# EAGLE design panel (EAGLE 7.2.0)
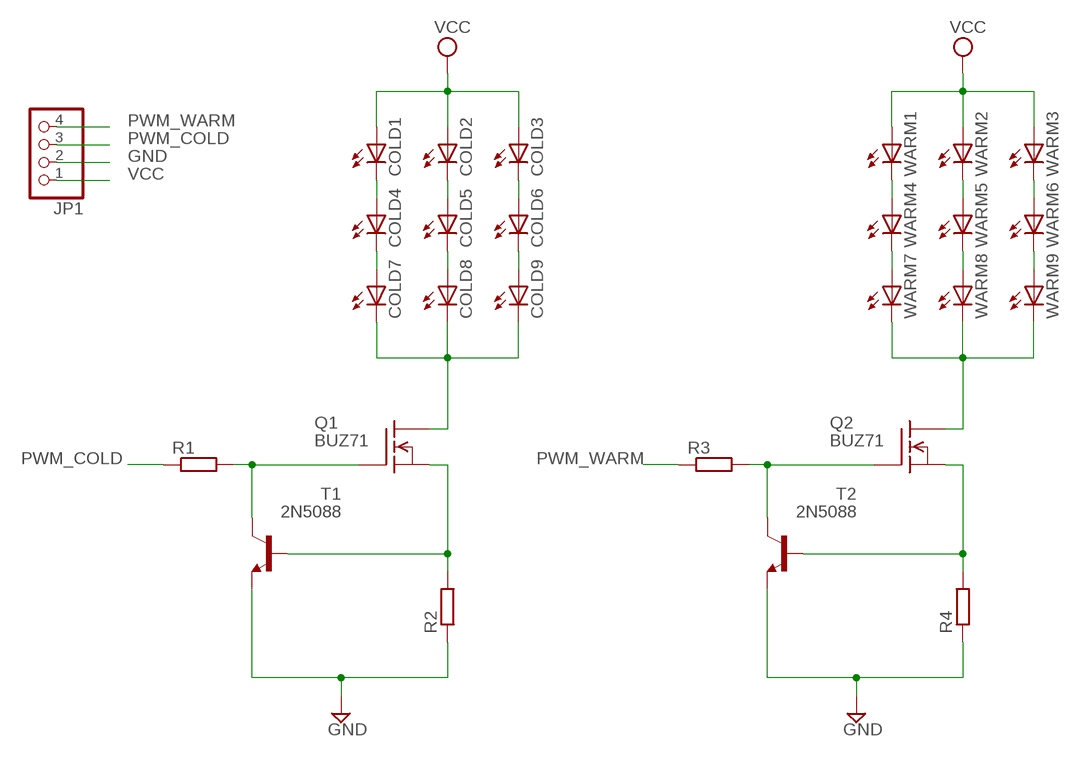
[diagram p0: schematic, sheet 1]

## Parts
COLD1  LEDP-LCC-2  [P-LCC-2]
COLD2  LEDP-LCC-2  [P-LCC-2]
COLD3  LEDP-LCC-2  [P-LCC-2]
COLD4  LEDP-LCC-2  [P-LCC-2]
COLD5  LEDP-LCC-2  [P-LCC-2]
COLD6  LEDP-LCC-2  [P-LCC-2]
COLD7  LEDP-LCC-2  [P-LCC-2]
COLD8  LEDP-LCC-2  [P-LCC-2]
COLD9  LEDP-LCC-2  [P-LCC-2]
JP1  PINHD-1X4  [1X04]
Q1  BUZ71  [TO220]
Q2  BUZ71  [TO220]
R1  R-EU_0207/10  [0207/10]
R2  R-EU_0207/10  [0207/10]
R3  R-EU_0207/10  [0207/10]
R4  R-EU_0207/10  [0207/10]
T1  2N5088  [TO92]
T2  2N5088  [TO92]
WARM1  LEDP-LCC-2  [P-LCC-2]
WARM2  LEDP-LCC-2  [P-LCC-2]
WARM3  LEDP-LCC-2  [P-LCC-2]
WARM4  LEDP-LCC-2  [P-LCC-2]
WARM5  LEDP-LCC-2  [P-LCC-2]
WARM6  LEDP-LCC-2  [P-LCC-2]
WARM7  LEDP-LCC-2  [P-LCC-2]
WARM8  LEDP-LCC-2  [P-LCC-2]
WARM9  LEDP-LCC-2  [P-LCC-2]

## Nets
GND: JP1.2 R2.1 R4.1 T1.3(E) T2.3(E)
N$1: COLD1.C COLD4.A
N$2: COLD4.C COLD7.A
N$3: COLD2.C COLD5.A
N$4: COLD5.C COLD8.A
N$5: COLD3.C COLD6.A
N$6: COLD6.C COLD9.A
N$7: COLD7.C COLD8.C COLD9.C Q1.2(D)
N$8: Q1.3(S) R2.2 T1.2(B)
N$9: WARM1.C WARM4.A
N$10: Q1.1(G) R1.2 T1.1(C)
N$11: WARM4.C WARM7.A
N$12: WARM2.C WARM5.A
N$13: WARM5.C WARM8.A
N$14: WARM3.C WARM6.A
N$16: Q2.2(D) WARM7.C WARM8.C WARM9.C
N$17: Q2.3(S) R4.2 T2.2(B)
N$18: Q2.1(G) R3.2 T2.1(C)
PWM_COLD: JP1.3 R1.1
PWM_WARM: JP1.4 R3.1
VCC: COLD1.A COLD2.A COLD3.A JP1.1 WARM1.A WARM2.A WARM3.A
WARM6: WARM6.C WARM9.A

## Library data of the parts
COLD1-COLD9 WARM1-WARM9 = led:LED: LED OSRAM: - CHIPLED LG R971, LG N971, LY N971, LG Q971, LY Q971, LO R971, LY R971 LH N974, LH R974 LS Q976, LO Q976, LY Q976 LO Q996 - Hyper CHIPLED LW Q18S LB Q993, LB Q99A, LB R99A - SideLED LS A670, LO A670, LY A670, LG A670, LP A670 LB A673, LV A673, LT A673, LW A673 LH A674 LY A675 LS A676, LA A676, LO A676, LY A676, LW A676 LS A679, LY A679, LG A679 - Hyper Micro SIDELED® LS Y876, LA Y876, LO Y876, LY Y876 LT Y87S - SmartLED LW L88C, LW L88S LB L89C, LB L89S, LG L890 LS L89K, LO L89K, LY L89K LS L896, LA L896, LO L896, LY L896 - TOPLED LS T670, LO T670, LY T670, LG T670, LP T670 LSG T670, LSP T670, LSY T670, LOP T670, LYG T670 LG T671, LOG T671, LSG T671 LB T673, LV T673, LT T673, LW T673 LH T674 LS T676, LA T676, LO T676, LY T676, LB T676, LH T676, LSB T676, LW T676 LB T67C, LV T67C, LT T67C, LS T67K, LO T67K, LY T67K, LW E67C LS E67B, LA E67B, LO E67B, LY E67B, LB E67C, LV E67C, LT E67C LW T67C LS T679, LY T679, LG T679 LS T770, LO T770, LY T770, LG T770, LP T770 LB T773, LV T773, LT T773, LW T773 LH T774 LS E675, LA E675, LY E675, LS T675 LS T776, LA T776, LO T776, LY T776, LB T776 LHGB T686 LT T68C, LB T68C - Hyper Mini TOPLED® LB M676 - Mini TOPLED Santana® LG M470 LS M47K, LO M47K, LY M47K Source: http://www.osram.convergy.de LUXEON: - LUMILED® LXK2-PW12-R00, LXK2-PW12-S00, LXK2-PW14-U00, LXK2-PW14-V00 LXK2-PM12-R00, LXK2-PM12-S00, LXK2-PM14-U00 LXK2-PE12-Q00, LXK2-PE12-R00, LXK2-PE12-S00, LXK2-PE14-T00, LXK2-PE14-U00 LXK2-PB12-K00, LXK2-PB12-L00, LXK2-PB12-M00, LXK2-PB14-N00, LXK2-PB14-P00, LXK2-PB14-Q00 LXK2-PR12-L00, LXK2-PR12-M00, LXK2-PR14-Q00, LXK2-PR14-R00 LXK2-PD12-Q00, LXK2-PD12-R00, LXK2-PD12-S00 LXK2-PH12-R00, LXK2-PH12-S00 LXK2-PL12-P00, LXK2-PL12-Q00, LXK2-PL12-R00 Source: www.luxeon.com KINGBRIGHT: KA-3528ASYC Source: www.kingbright.com
JP1 = pinhead:PINHD-1X4: PIN HEADER
Q1 Q2 = transistor-fet:BUZ71: N-Channel Enhancement MOSFET 50V; 14A; 0,1Ohm
R1-R4 = resistor:R-EU_: RESISTOR, European symbol
T1 T2 = transistor:2N5088: NPN TRANSISTOR

## Board
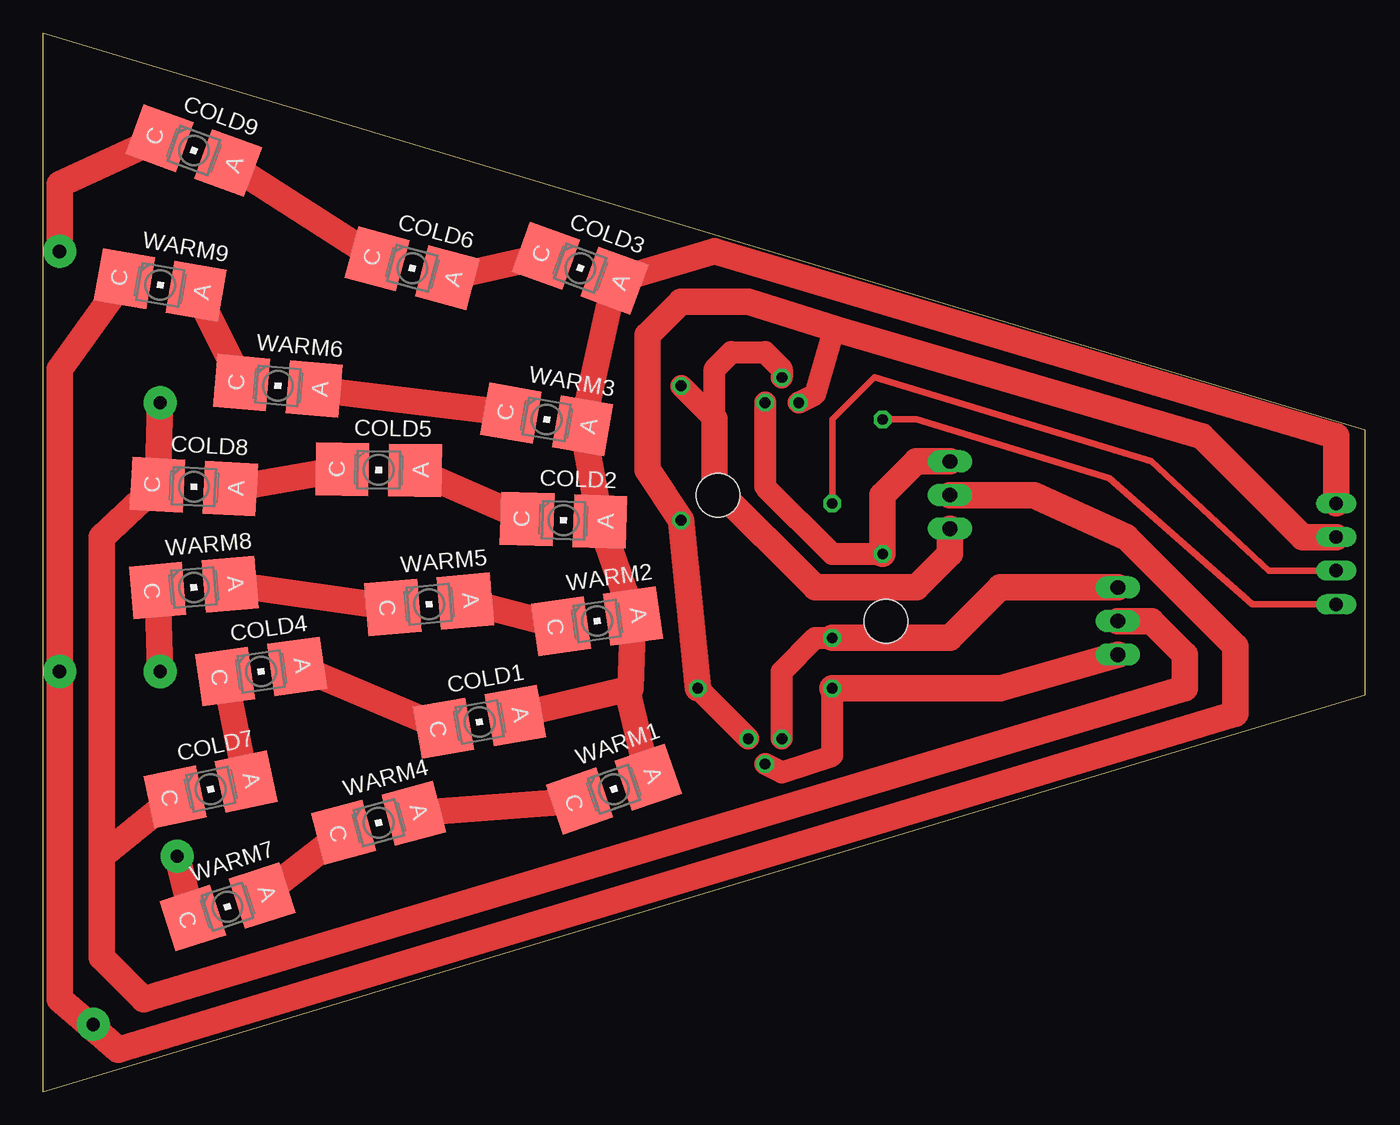
[diagram p1: board, top side]
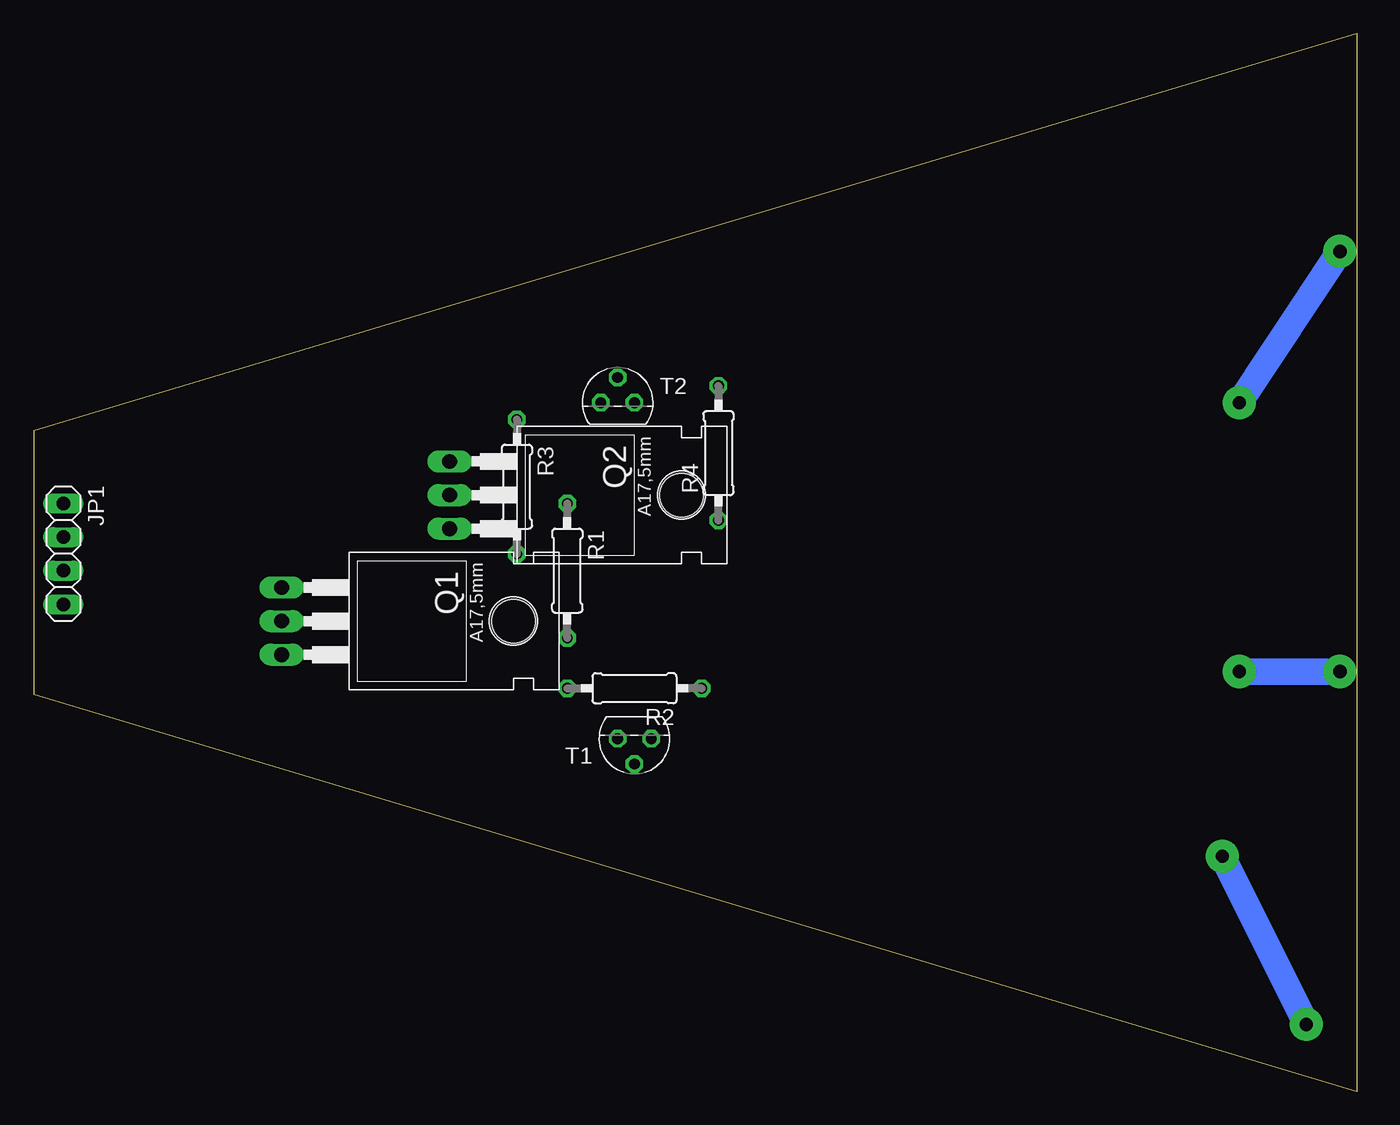
[diagram p2: board, bottom side, seen from below]

Size 100 x 80 mm. Coordinates in mm from the lower left corner, seen from the top.
Outline: 0,0 100,30 100,50 0,80 0,0
Copper layers (1*16): Top 0.035mm / dielectric 1.5mm / Bottom 0.035mm
Design rules "default": minimum track width 10mil, minimum drill 24mil, track to track 8mil, track to pad 8mil, pad to pad 8mil, via to via 8mil, smd to smd 8mil, copper to edge 40mil, drill to drill 8mil, minimum pad ring 10mil, minimum via ring 8mil, stop-mask expansion 4mil, vias tented up to drill 0mil, thermal gap 10mil

### Footprints (pad centres in the part's own frame; a part is rotated, then mirrored left to right if it is on the bottom)
P-LCC-2 = smd 4 x 4: A 0,2.75; C 0,-2.75
1X04 = drill 1.016 long: 1 -3.81,0; 2 -1.27,0; 3 1.27,0; 4 3.81,0
TO220 = drill 1.118 long: 1 -2.54,-6.35; 2 0,-6.35; 3 2.54,-6.35 | hole 3.302: 0,11.176
0207/10 = drill 0.813 octagon: 1 -5.08,0; 2 5.08,0
TO92 = drill 0.813 octagon: 1 1.27,0; 2 0,1.905; 3 -1.27,0

### Placement (x,y rotation side)
COLD1  33.02,27.94 280 top
COLD2  39.37,43.18 268 top
COLD3  40.64,62.23 250 top
COLD4  16.51,31.75 278 top
COLD5  25.4,46.99 269 top
COLD6  27.94,62.23 255 top
COLD7  12.7,22.86 282 top
COLD8  11.43,45.72 267 top
COLD9  11.43,71.12 250 top
JP1  97.79,40.64 270 bottom
Q1  74.93,35.56 270 bottom
Q2  62.23,45.09 270 bottom
R1  59.69,39.37 270 bottom
R2  54.61,30.48 180 bottom
R3  63.5,45.72 270 bottom
R4  48.26,48.26 90 bottom
T1  54.61,26.67 180 bottom
T2  55.88,52.07 0 bottom
WARM1  43.18,22.86 289 top
WARM2  41.91,35.56 278 top
WARM3  38.1,50.8 260 top
WARM4  25.4,20.32 285 top
WARM5  29.21,36.83 275 top
WARM6  17.78,53.34 265 top
WARM7  13.97,13.97 288 top
WARM8  11.43,38.1 275 top
WARM9  8.89,60.96 260 top

### Tracks (layer width: path | path; a pad name or v marks a point on that pad's centre or on a via)
GND
  Top 1.676: T2.3 58.42,52.7 59.84,57.67 | R2.1 T1.3
  Top 2: JP1.2 95.25,41.91 87.63,49.53 59.84,57.67 53.34,59.69 48.26,59.69 45.72,57.15 45.72,46.99 R4.1 R2.1
N$1
  Top 2: COLD4.A COLD1.C
N$2
  Top 2: COLD7.A COLD4.C
N$3
  Top 2: COLD5.A COLD2.C
N$4
  Top 2: COLD8.A COLD5.C
N$5
  Top 2: COLD6.A COLD3.C
N$6
  Top 2: COLD9.A COLD6.C
N$7  (via drill 1 pad 2.5)
  Top 2: Q1.2 83.82,35.56 86.36,33.02 86.36,30.48 7.62,6.99 4.45,10.16 4.45,17.78 | 4.45,17.78 COLD7.C | 4.45,17.78 4.45,41.91 COLD8.C v8.89,52.07 | COLD9.C 1.27,68.58 v1.27,63.5
  Bottom 2: v1.27,63.5 v8.89,52.07
N$8
  Top 1.676: T1.2 55.88,24.13 59.69,25.4 R2.2
  Top 2: Q1.3 72.39,30.48 R2.2
N$9
  Top 2: WARM1.C WARM4.A
N$10
  Top 1.676: T1.1 55.88,31.75 58.42,34.29 R1.2
  Top 2: R1.2 68.58,34.29 72.39,38.1 Q1.1
N$11
  Top 2: WARM4.C WARM7.A
N$12
  Top 2: WARM5.A WARM2.C
N$13
  Top 2: WARM8.A WARM5.C
N$14
  Top 2: WARM6.A WARM3.C
N$16  (via drill 1 pad 2.5)
  Top 2: Q2.2 74.93,45.09 81.92,41.91 90.17,33.66 90.17,28.57 5.71,3.17 3.68,4.92 | 3.68,4.92 1.27,6.99 v1.27,31.75 1.27,54.61 WARM9.C | v3.81,5.08 3.68,4.92 | WARM7.C v10.16,17.78 | WARM8.C v8.89,31.75
  Bottom 2: v1.27,31.75 v8.89,31.75 | v3.81,5.08 v10.16,17.78
N$17
  Top 1.676: T2.2 55.88,54.61 54.61,55.88 52.07,55.88 50.8,54.61 50.8,50.8 R4.2
  Top 2: Q2.3 68.58,40.64 66.04,38.1 58.42,38.1 50.8,45.72 50.8,50.8
N$18
  Top 1.676: T2.1 54.61,45.72 59.69,40.64 R3.2
  Top 2: Q2.1 66.04,47.62 63.5,45.09 R3.2
PWM_COLD
  Top 0.5: JP1.3 92.71,39.37 83.82,47.62 62.87,53.98 59.69,50.8 R1.1
PWM_WARM
  Top 0.5: JP1.4 91.44,36.83 80.64,46.35 66.04,50.8 R3.1
VCC
  Top 2: COLD1.A 44.17,30.41 | 44.17,30.41 44.45,30.48 WARM2.A COLD2.A WARM3.A COLD3.A 50.8,63.5 97.79,49.53 JP1.1 | WARM1.A 44.17,30.41
WARM6
  Top 2: WARM9.A WARM6.C